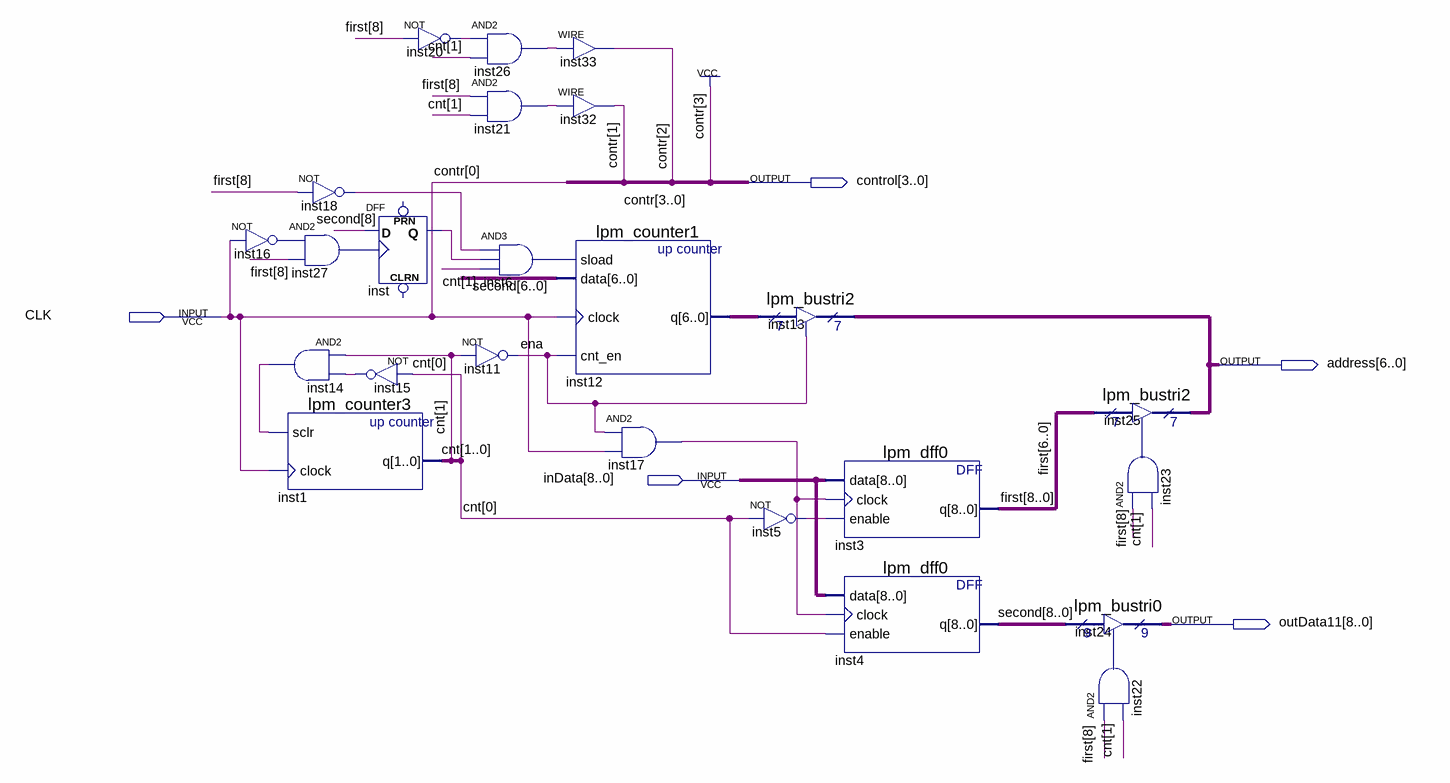
[diagram p0: schematic sheet]
// Quartus schematic CU.bdf as structural Verilog: 24 symbols, 5 pins
module CU (
  input  CLK,
  input  [8:0] inData,
  output [3:0] control,
  output [6:0] address,
  output [8:0] outData11
);

  wire ena, inst5_out, inst6_out, inst14_out, inst15_out, inst16_out, inst17_out, inst18_out, inst20_out,
       inst21_out, inst22_out, inst23_out, inst26_out, inst27_out, inst_q;
  wire [1:0] cnt;
  wire [6:0] inst12_q;
  wire [8:0] first, second;

  not inst16 (inst16_out, CLK);
  and inst14 (inst14_out, cnt[1], inst15_out);
  lpm_counter3 inst1 (.sclr(inst14_out), .clock(CLK), .q(cnt));
  not inst18 (inst18_out, first[8]);
  and inst27 (inst27_out, inst16_out, first[8]);
  not inst20 (inst20_out, first[8]);
  DFF inst (.CLK(inst27_out), .D(second[8]), .Q(inst_q));  // open: CLRN, PRN
  not inst15 (inst15_out, cnt[0]);
  and inst26 (inst26_out, inst20_out, cnt[1]);
  and inst21 (inst21_out, first[8], cnt[1]);
  and inst6 (inst6_out, inst18_out, inst_q, cnt[1]);
  not inst11 (ena, cnt[1]);
  assign control[2] = inst26_out;  // WIRE inst33
  assign control[1] = inst21_out;  // WIRE inst32
  lpm_counter1 inst12 (.sload(inst6_out), .data(second[6:0]), .clock(CLK), .cnt_en(ena), .q(inst12_q));
  and inst17 (inst17_out, ena, CLK);
  lpm_bustri2 inst13 (.enabledt(ena), .data(inst12_q), .tridata(address));
  not inst5 (inst5_out, cnt[0]);
  lpm_dff0 inst3 (.data(inData), .clock(inst17_out), .enable(inst5_out), .q(first));
  lpm_dff0 inst4 (.data(inData), .clock(inst17_out), .enable(cnt[0]), .q(second));
  lpm_bustri2 inst25 (.enabledt(inst23_out), .data(first[6:0]), .tridata(address));
  and inst23 (inst23_out, first[8], cnt[1]);
  lpm_bustri0 inst24 (.enabledt(inst22_out), .data(second), .tridata(outData11));
  and inst22 (inst22_out, first[8], cnt[1]);

  assign {control[3], control[0]} = {1'b1, CLK};

  // Other names for the same wires on the sheet: contr[2:0] = {control[2:1], CLK}
endmodule
